# EAGLE schematic anpu (EAGLE 9.6.2)
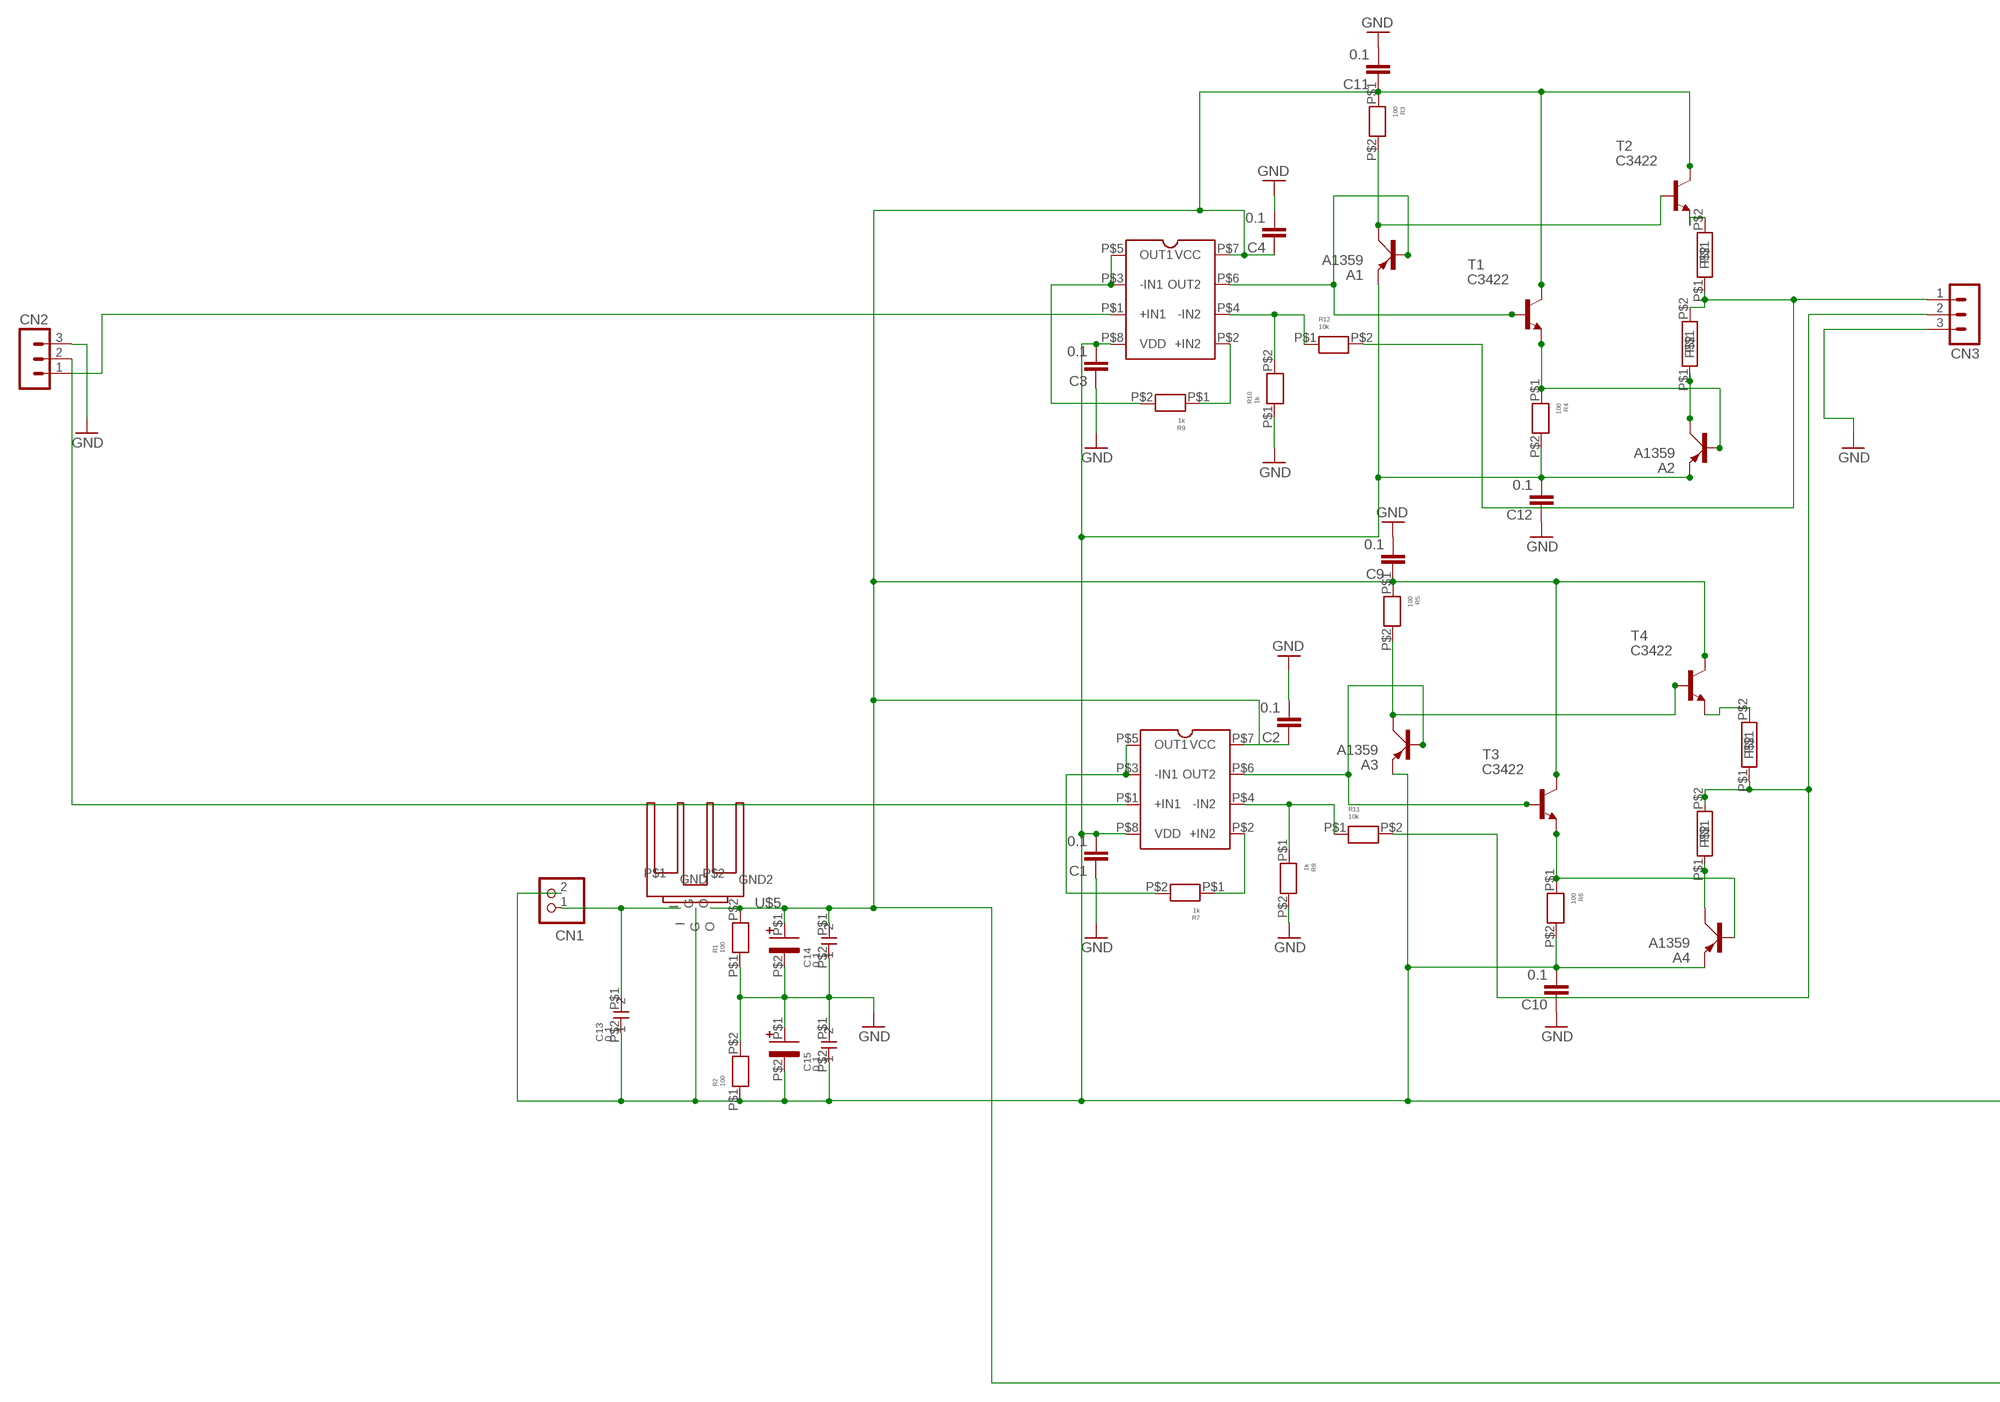
[diagram p0: schematic, sheet 1, part 1 of 2]
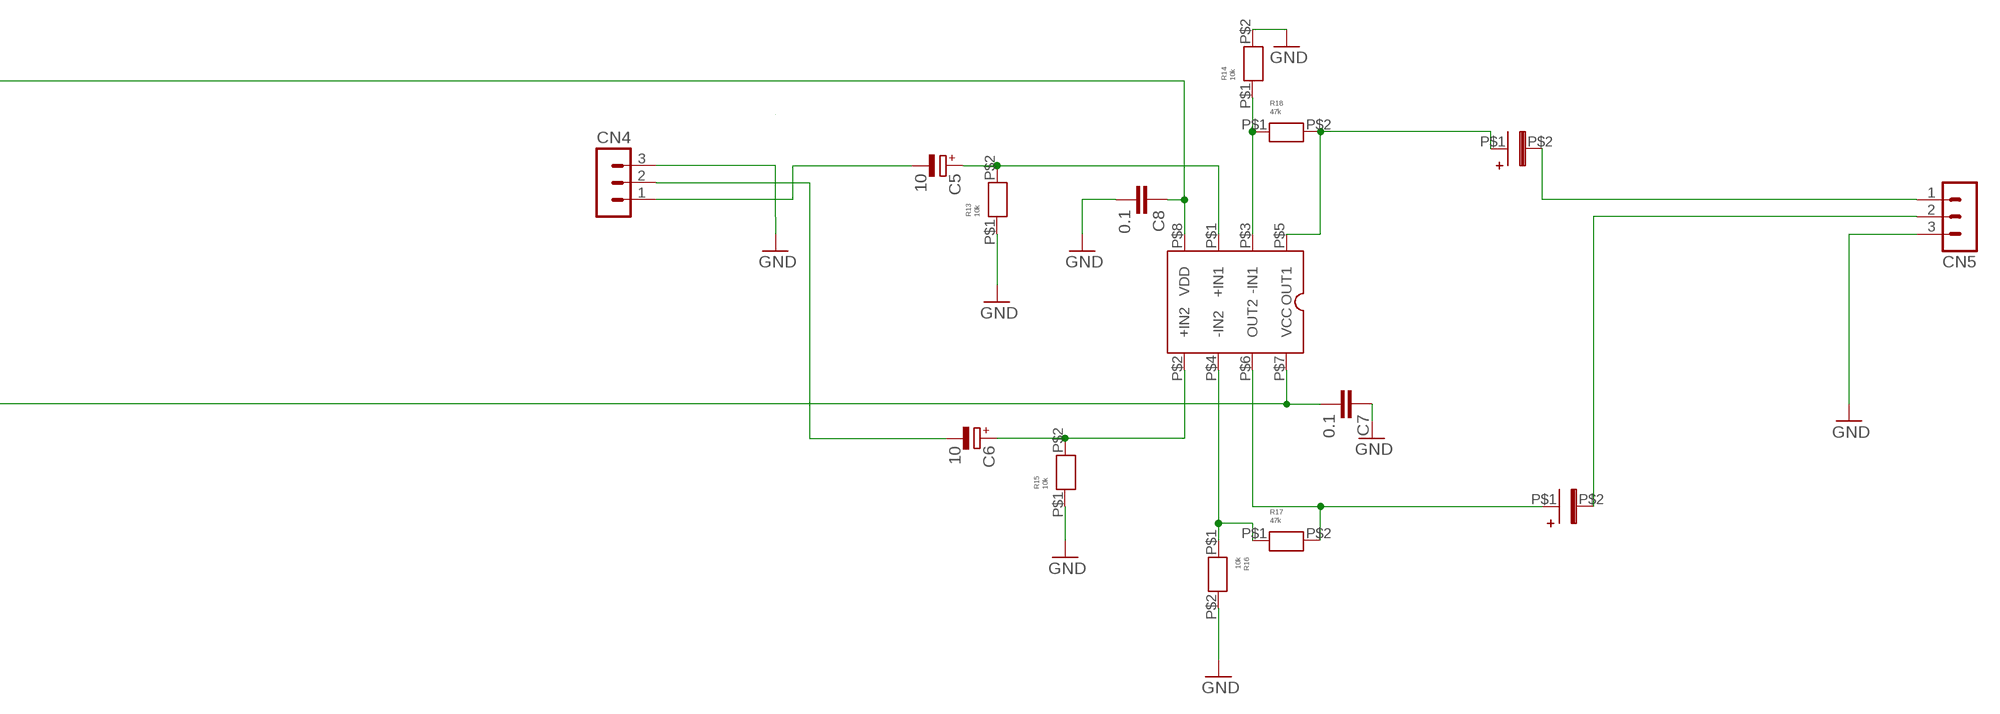
[diagram p1: schematic, sheet 1, part 2 of 2]

## Parts
A1  A1359  MJE2955  [TO220AV]
A2  A1359  MJE2955  [TO220AV]
A3  A1359  MJE2955  [TO220AV]
A4  A1359  MJE2955  [TO220AV]
C1  0.1  C-EU050-030X075  [C050-030X075]
C2  0.1  C-EU050-030X075  [C050-030X075]
C3  0.1  C-EU050-030X075  [C050-030X075]
C4  0.1  C-EU050-030X075  [C050-030X075]
C5  10  CPOL-EUE2.5-5  [E2,5-5]
C6  10  CPOL-EUE2.5-5  [E2,5-5]
C7  0.1  C-EU050-030X075  [C050-030X075]
C8  0.1  C-EU050-030X075  [C050-030X075]
C9  0.1  C-EU050-030X075  [C050-030X075]
C10  0.1  C-EU050-030X075  [C050-030X075]
C11  0.1  C-EU050-030X075  [C050-030X075]
C12  0.1  C-EU050-030X075  [C050-030X075]
C13  0.1  1608  [CON]
C14  0.1  1608  [CON]
C15  0.1  1608  [CON]
CN1  B2B-XH-A  [B2B-XH-A]
CN2  B3B-PH-K-S  [B3B-PH-K-S]
CN3  B3B-PH-K-S  [B3B-PH-K-S]
CN4  B3B-PH-K-S  [B3B-PH-K-S]
CN5  B3B-PH-K-S  [B3B-PH-K-S]
EC1  FG  [FG]
EC2  FG  [FG]
EC3  FG  [FG]
EC4  FG  [FG]
R1  100  R  [1608]
R2  100  R  [1608]
R3  100  R  [1608]
R4  100  R  [1608]
R5  100  R  [1608]
R6  100  R  [1608]
R7  1k  R  [1608]
R8  1k  R  [1608]
R9  1k  R  [1608]
R10  1k  R  [1608]
R11  10k  R  [1608]
R12  10k  R  [1608]
R13  10k  R  [1608]
R14  10k  R  [1608]
R15  10k  R  [1608]
R16  10k  R  [1608]
R17  47k  R  [1608]
R18  47k  R  [1608]
T1  C3422  2SC3212V  [TO220AV]
T2  C3422  2SC3212V  [TO220AV]
T3  C3422  2SC3212V  [TO220AV]
T4  C3422  2SC3212V  [TO220AV]
U$1  4580DD  [4580DD]
U$4  4580DD  [4580DD]
U$5  CONVERTER  [CONVERTER]
U$6  4580DD  [4580DD]
U$36  0.47  KINZOKUTEIKOU  [KINZOKUTEIKOU]
U$37  0.47  KINZOKUTEIKOU  [KINZOKUTEIKOU]
U$38  0.47  KINZOKUTEIKOU  [KINZOKUTEIKOU]
U$39  0.47  KINZOKUTEIKOU  [KINZOKUTEIKOU]

## Nets
GND: C1.1 C2.2 C3.1 C4.2 C7.1 C8.2 C9.2 C10.1 C11.2 C12.1 C14.P$2 C15.P$1 CN2.3 CN3.3 CN5.3 EC3.P$2 EC4.P$1 R1.P$1 R2.P$2 R8.P$2 R10.P$1 R13.P$1 R14.P$2 R15.P$1 R16.P$2
N$1: A3.B T3.1(B) U$1.P$6(OUT2)
N$2: A4.B R6.P$1 T3.3(E)
N$3: A3.C R5.P$2 T4.1(B)
N$4: CN3.1 R12.P$2 U$36.P$2 U$37.P$1
N$5: CN3.2 R11.P$2 U$38.P$1 U$39.P$2
N$6: A4.C U$39.P$1
N$8: CN2.2 U$1.P$1(+IN1)
N$9: R7.P$1 U$1.P$2(+IN2)
N$10: R7.P$2 U$1.P$3(-IN1) U$1.P$5(OUT1)
N$11: R8.P$1 R11.P$1 U$1.P$4(-IN2)
N$12: C13.P$1 CN1.1 U$5.I
N$13: CN4.3
N$14: A1.E A2.E A3.E A4.E C1.2 C3.2 C8.1 C10.2 C12.2 C13.P$2 C15.P$2 CN1.2 EC4.P$2 R2.P$1 R4.P$2 R6.P$2 U$1.P$8(VDD) U$4.P$8(VDD) U$5.G U$6.P$8(VDD)
N$20: A1.B T1.1(B) U$4.P$6(OUT2)
N$21: A2.B R4.P$1 T1.3(E)
N$23: A1.C R3.P$2 T2.1(B)
N$24: T2.3(E) U$37.P$2
N$25: CN2.1 U$4.P$1(+IN1)
N$26: A2.C U$36.P$1
N$27: T4.3(E) U$38.P$2
N$29: R9.P$1 U$4.P$2(+IN2)
N$30: R9.P$2 U$4.P$3(-IN1) U$4.P$5(OUT1)
N$31: R10.P$2 R12.P$1 U$4.P$4(-IN2)
N$48: C2.1 C4.1 C7.2 C9.1 C11.1 C14.P$1 EC3.P$1 R1.P$2 R3.P$1 R5.P$1 T1.2(C) T2.2(C) T3.2(C) T4.2(C) U$1.P$7(VCC) U$4.P$7(VCC) U$5.O U$6.P$7(VCC)
N$56: C6.- CN4.2
N$57: C5.- CN4.1
N$58: C5.+ R13.P$2 U$6.P$1(+IN1)
N$59: C6.+ R15.P$2 U$6.P$2(+IN2)
N$61: R14.P$1 R18.P$1 U$6.P$3(-IN1)
N$63: R16.P$1 R17.P$1 U$6.P$4(-IN2)
N$64: EC1.P$1 R17.P$2 U$6.P$6(OUT2)
N$65: EC2.P$1 R18.P$2 U$6.P$5(OUT1)
N$66: CN5.2 EC1.P$2
N$67: CN5.1 EC2.P$2
Unconnected: U$5.P$1(GND) U$5.P$2(GND2)

## Library data of the parts
A1-A4 = transistor-power:MJE2955: PNP TRANSISTOR
C1-C4 C7-C12 = rcl:C-EU: CAPACITOR, European symbol; SPICEPREFIX: C
C5 C6 = rcl:CPOL-EU: POLARIZED CAPACITOR, European symbol; SPICEPREFIX: C
C13-C15 = con1608:1608
CN1 = jst-xh:B2B-XH-A: Wire-to-Board 2.5mm pitch top mount connector Source: http://www.jst-mfg.com/product/pdf/jpn/XH.pdf http://www.jst-mfg.com/product/detail.php?series=277
CN2-CN5 = con-JST PH:B3B-PH: JST PH series header 2.00mm pitch disconnectable crimp style connectors, vertical (side entry type), 3 pins
EC1-EC4 = C FG:FG
R1-R18 = R 1608:R
T1-T4 = transistor:2SC3212: NPN Epitaxial Planar Trnasitor RF Power Amplifier Source: 2SC3212.pdf
U$1 U$4 U$6 = 4580DD:4580DD
U$5 = converter:CONVERTER
U$36-U$39 = 金属抵抗:KINZOKUTEIKOU